# Altium schematic sheet Mod_01.SchDoc
size A; SheetNumber: 1; SheetTotal: 1
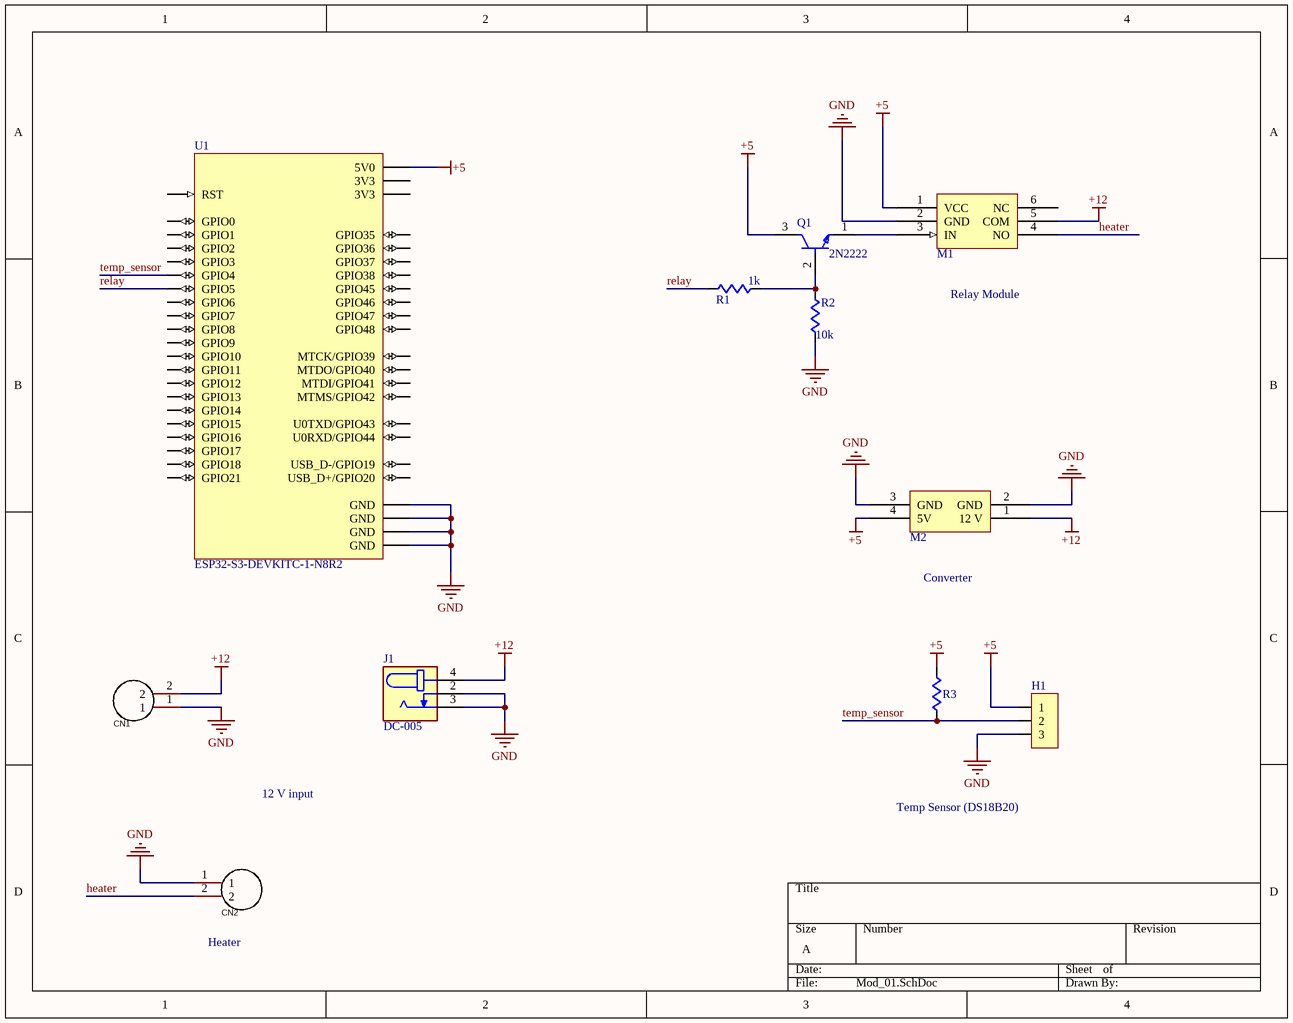
[diagram p0: Mod_01.SchDoc]

## Parts
CN1  WJ2EDGRC-5.08-2P  [Terminal Block P5.08-2P]  (value not drawn)
CN2  WJ2EDGRC-5.08-2P  [Terminal Block P5.08-2P]  (value not drawn)
H1  Header 1x3  [Header 1x3 male]  (value not drawn)
J1  DC-005  [NINIGI_DC-005]
M1  Relay Mod  [Relay Mod1]  (value not drawn)
M2  LM2596  [LM2596 Mod]  (value not drawn)
Q1  2N2222  [FP-JAN2N2222A-MFG]
R1  1k  [RESA60-630X240]
R2  10k  [RESA60-630X240]
R3  4.7k  [RESA60-630X240]  (value not drawn)
U1  ESP32-S3-DEVKITC-1-N8R2  [XCVR_ESP32-S3-DEVKITC-1-N8R2]

## Nets
+5: H1.1 M1.1(VCC) M2.4(5V) Q1.3(C) R3.2 U1.J1_21(5V0)
+12: CN1.2 J1.4 M1.5(COM) M2.1(12_V)
GND: CN1.1 CN2.1 H1.3 J1.2 J1.3 M1.2(GND) M2.2(GND) M2.3(GND) R2.1 U1.J1_22(GND) U1.J3_1(GND) U1.J3_21(GND) U1.J3_22(GND)
heater: CN2.2 M1.4(NO)
relay: R1.1 U1.J1_5(GPIO5)
temp_sensor: H1.2 R3.1 U1.J1_4(GPIO4)
NetM1_3: M1.3(IN) Q1.1(E)
NetQ1_2: Q1.2(B) R1.2 R2.2

Not connected (* = marked no-connect by the designer): M1 6(NC); U1 J1_1(3V3) J1_2(3V3) J1_3(RST) J1_6(GPIO6) J1_7(GPIO7) J1_8(GPIO15) J1_9(GPIO16) J1_10(GPIO17) J1_11(GPIO18) J1_12(GPIO8) J1_13(GPIO3) J1_14(GPIO46) J1_15(GPIO9) J1_16(GPIO10) J1_17(GPIO11) J1_18(GPIO12) J1_19(GPIO13) J1_20(GPIO14) J3_2(U0TXD/GPIO43) J3_3(U0RXD/GPIO44) J3_4(GPIO1) J3_5(GPIO2) J3_6(MTMS/GPIO42) J3_7(MTDI/GPIO41) J3_8(MTDO/GPIO40) J3_9(MTCK/GPIO39) J3_10(GPIO38) J3_11(GPIO37) J3_12(GPIO36) J3_13(GPIO35) J3_14(GPIO0) J3_15(GPIO45) J3_16(GPIO48) J3_17(GPIO47) J3_18(GPIO21) J3_19(USB_D+/GPIO20) J3_20(USB_D-/GPIO19)

## Notes on the sheet
- Relay Module
- Converter
- 12 V input
- Temp Sensor (DS18B20)
- (near CN2) Heater

## Library data of the parts
CN1 CN2 = WJ2EDGRC-5.08-2P: Manufacturer: KANGNEX(康奈克斯电气); Add into BOM: yes; Connector Type: 板端/Receptacle-Close; Structure: 1x2P; Pitch: 5.08mm; Number of PINs Per Row: 2; Symbol: WJ2EDGRC-5.08-2P; Device: WJ2EDGRC-5.08-2P; Supplier: LCSC; Manufacturer Part: WJ2EDGRC-5.08-2P; Supplier Part: C3697; JLCPCB Part Class: Extended Part; LCSC Part Name: 5.08mm 1x2P 排数:1 每排P数:2; Supplier Footprint: 弯插,P=5.08mm; Datasheet: https://atta.szlcsc.com/upload/public/pdf/source/20191225/C3697_6E7B45CD3FD3DA2CDF6A2CE707235E10.pdf; Convert to PCB: yes; Color: Green; Mounting Style: Bend; Number of Pins: 2P; Number of Rows: 1
J1 = DC-005: DC Jack; Availability: Unavailable; MP: DC-005; Value: *; Package: None; Price: None
M2 = LM2596 Mod
Q1 = CMP-06366-000013-1: TRANS NPN 50V 0.8A TO218
R1 R2 = CMP-1659-00075-1: Axial Resistor,; Tolerance: 1%; Voltage Rating: 250 V; Resistance: 1 kohm; Power Rating: 250 mW; ComponentLink2Description: Datasheet; RoHSCompliant: true; PackageReference: MFR-25; Case\Package: Axial; Max Operating Temperature: 155 degC; DatasheetVersion: Apr-13; ComponentLink1URL: http://www.yageo.com/; Length: 0.248 inch; ComponentLink2URL: http://www.yageo.com/documents/recent/Yageo%20LR_MFR_2013.pdf; Packaging: Bulk; Package Quantity: 200; PackageDescription: 2-Pin Axial Lead, Dia 2.4 mm, Body Length 6.3 mm; Min Operating Temperature: -55 degC; ComponentLink1Description: Manufacturer URL
R3 = CMP-1659-00075-1_1: Axial Resistor,; Tolerance: 1%; Voltage Rating: 250 V; Resistance: 1 kohm; Power Rating: 250 mW; ComponentLink2Description: Datasheet; RoHSCompliant: true; PackageReference: MFR-25; Case\Package: Axial; Max Operating Temperature: 155 degC; DatasheetVersion: Apr-13; ComponentLink1URL: http://www.yageo.com/; Length: 0.248 inch; ComponentLink2URL: http://www.yageo.com/documents/recent/Yageo%20LR_MFR_2013.pdf; Packaging: Bulk; Package Quantity: 200; PackageDescription: 2-Pin Axial Lead, Dia 2.4 mm, Body Length 6.3 mm; Min Operating Temperature: -55 degC; ComponentLink1Description: Manufacturer URL
U1 = ESP32-S3-DEVKITC-1-N8R2: WiFi Development Tools - 802.11 (Engineering Samples Only) ESP32-S3 General-Purpose Development Board, ESP32-S3-WROOM-1-N8R2, with Pin Header; MF: Espressif Systems; SnapEDA_Link: https://www.snapeda.com/parts/ESP32-S3-DEVKITC-1-N8R2/Espressif+Systems/view-part/?ref=snap; Package: None; Value: *; MP: ESP32-S3-DEVKITC-1-N8R2; Check_prices: https://www.snapeda.com/parts/ESP32-S3-DEVKITC-1-N8R2/Espressif+Systems/view-part/?ref=eda